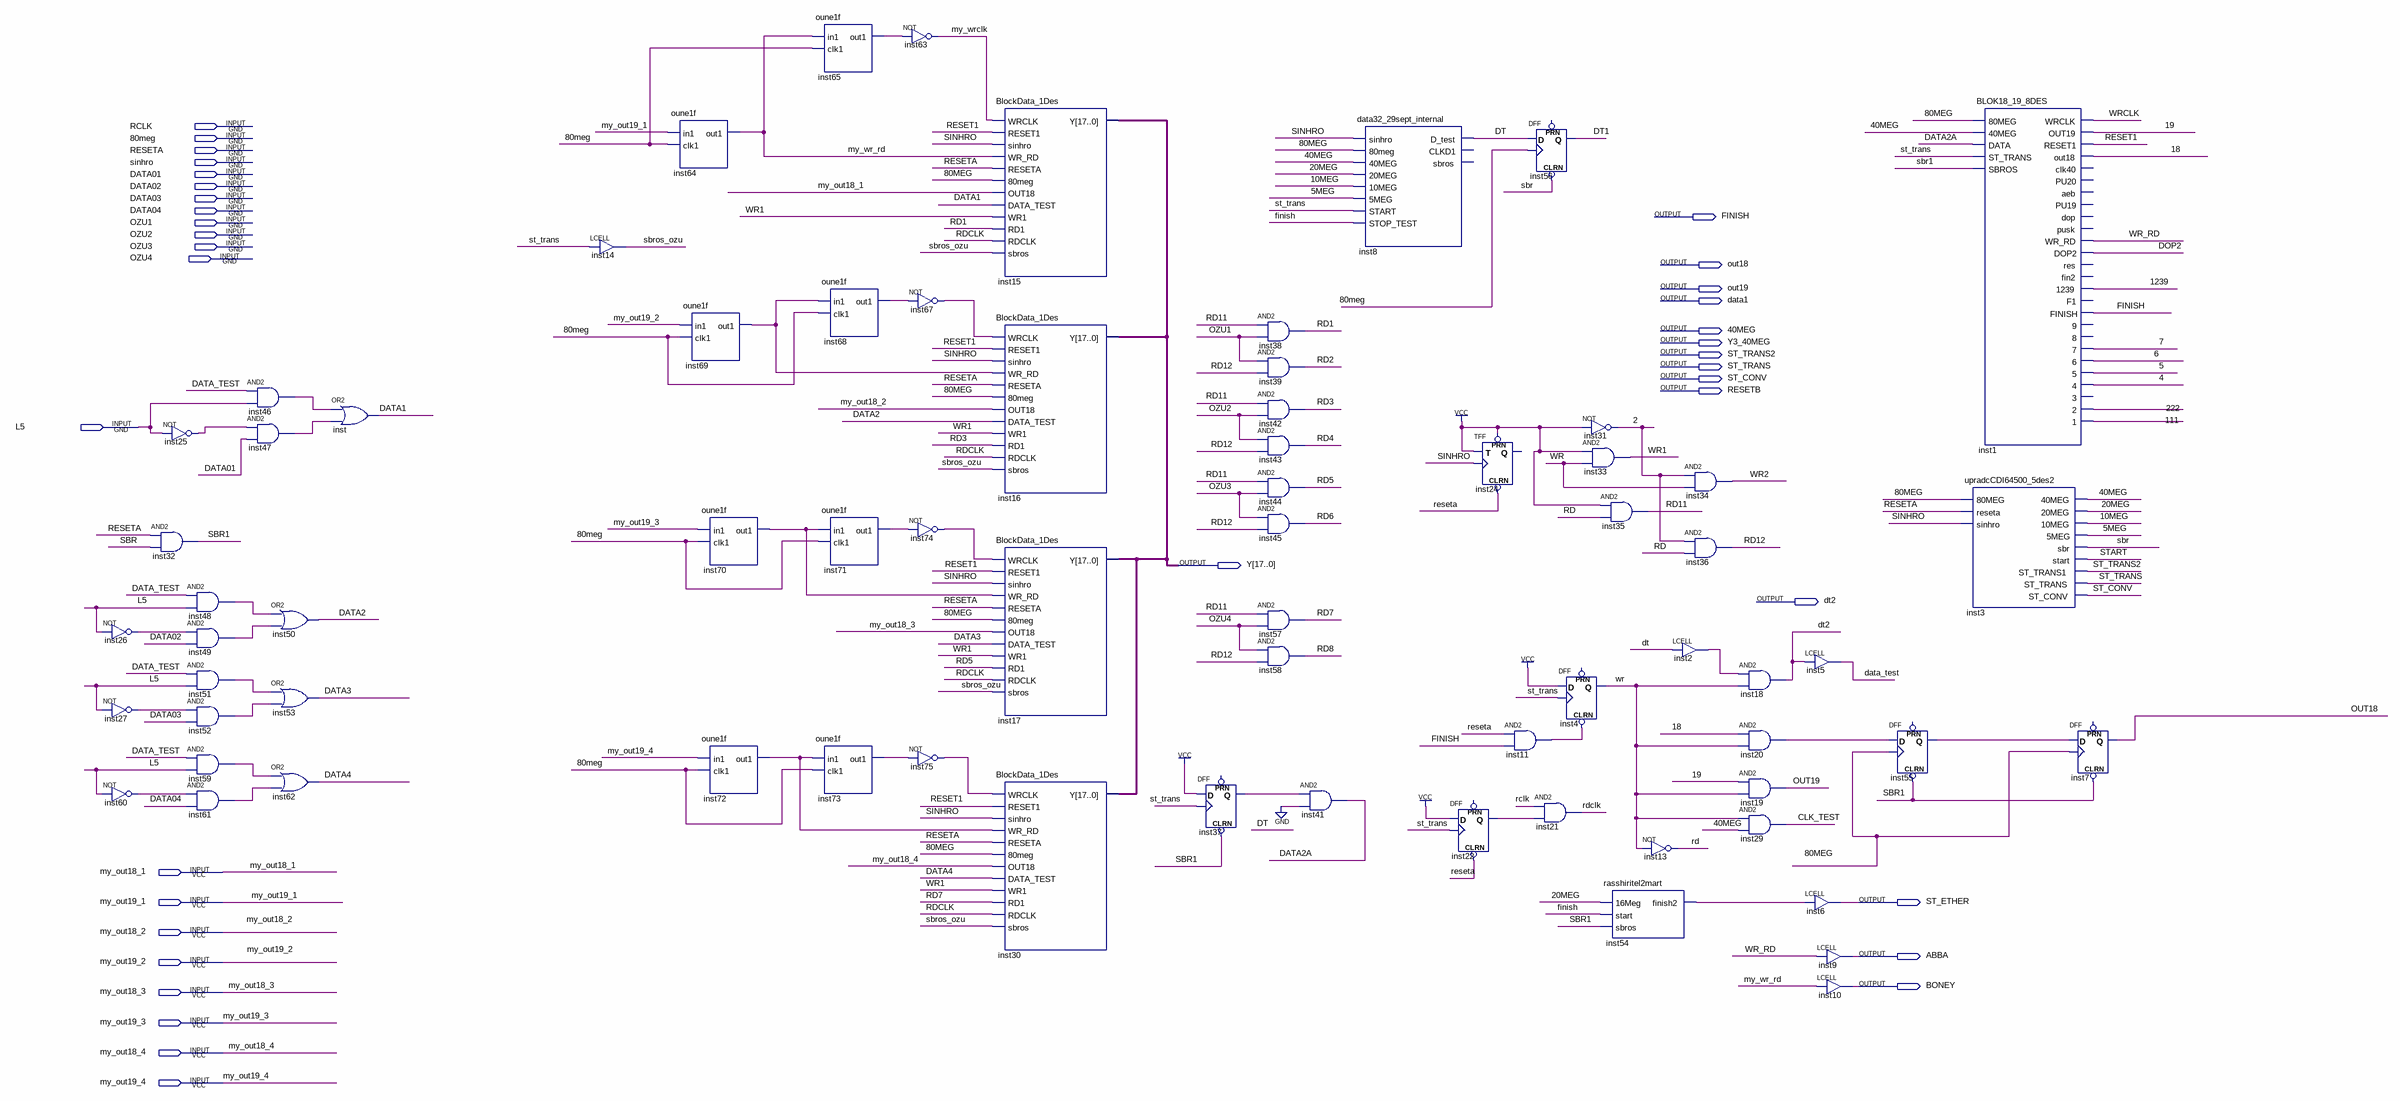
[diagram p0: schematic sheet]
// Quartus schematic blok_DATA_CDI_9des.bdf as structural Verilog: 71 symbols, 36 pins
module blok_DATA_CDI_9des (
  input  RCLK,
  input  \80meg ,
  input  RESETA,
  input  sinhro,
  input  DATA01,
  input  DATA02,
  input  DATA03,
  input  DATA04,
  input  OZU1,
  input  OZU2,
  input  OZU3,
  input  OZU4,
  input  L5,
  input  my_out18_1,
  input  my_out19_1,
  input  my_out18_2,
  input  my_out19_2,
  input  my_out18_3,
  input  my_out19_3,
  input  my_out18_4,
  input  my_out19_4,
  output FINISH,
  output out18,
  output out19,
  output data1,
  output \40MEG ,
  output Y3_40MEG,
  output ST_TRANS2,
  output ST_TRANS,
  output ST_CONV,
  output RESETB,
  output [17:0] Y,
  output dt2,
  output ST_ETHER,
  output ABBA,
  output BONEY
);

  wire \2 , \4 , \5 , \5MEG , \6 , \7 , \10MEG , \18 , \19 , \20MEG , \111 , \222 , \1239 , CLK_TEST, DATA2,
       DATA2A, DATA3, DATA4, data_test, DOP2, dt, DT1, inst2_out, inst11_out, inst20_out, inst22_q,
       inst25_out, inst26_out, inst27_out, inst37_q, inst46_out, inst47_out, inst48_out, inst49_out,
       inst51_out, inst52_out, inst54_finish2, inst55_q, inst59_out, inst60_out, inst61_out, inst65_out1,
       inst67_out, inst68_out1, inst69_out1, inst70_out1, inst71_out1, inst72_out1, inst73_out1, inst74_out,
       inst75_out, my_wr_rd, my_wrclk, RD, RD1, RD2, RD3, RD4, RD5, RD6, RD7, RD8, RD11, RD12, rdclk, RESET1,
       sbr, SBR1, sbros_ozu, START, WR, WR1, WR2, WR_RD, WRCLK;

  not inst26 (inst26_out, L5);
  not inst27 (inst27_out, L5);
  not inst60 (inst60_out, L5);
  not inst25 (inst25_out, L5);
  and inst32 (SBR1, RESETA, sbr);
  and inst48 (inst48_out, data_test, L5);
  and inst49 (inst49_out, inst26_out, DATA02);
  and inst51 (inst51_out, data_test, L5);
  and inst52 (inst52_out, inst27_out, DATA03);
  and inst59 (inst59_out, data_test, L5);
  and inst61 (inst61_out, inst60_out, DATA04);
  and inst46 (inst46_out, data_test, L5);
  and inst47 (inst47_out, inst25_out, DATA01);
  or inst50 (DATA2, inst48_out, inst49_out);
  or inst53 (DATA3, inst51_out, inst52_out);
  or inst62 (DATA4, inst59_out, inst61_out);
  or inst (data1, inst46_out, inst47_out);
  LCELL inst14 (.IN(ST_TRANS), .OUT(sbros_ozu));
  oune1f inst64 (.in1(my_out19_1), .clk1(\80meg ), .out1(my_wr_rd));
  oune1f inst69 (.in1(my_out19_2), .clk1(\80meg ), .out1(inst69_out1));
  oune1f inst70 (.in1(my_out19_3), .clk1(\80meg ), .out1(inst70_out1));
  oune1f inst72 (.in1(my_out19_4), .clk1(\80meg ), .out1(inst72_out1));
  oune1f inst65 (.in1(my_wr_rd), .clk1(\80meg ), .out1(inst65_out1));
  oune1f inst68 (.in1(inst69_out1), .clk1(\80meg ), .out1(inst68_out1));
  oune1f inst71 (.in1(inst70_out1), .clk1(\80meg ), .out1(inst71_out1));
  oune1f inst73 (.in1(inst72_out1), .clk1(\80meg ), .out1(inst73_out1));
  not inst63 (my_wrclk, inst65_out1);
  not inst67 (inst67_out, inst68_out1);
  not inst74 (inst74_out, inst71_out1);
  not inst75 (inst75_out, inst73_out1);
  BlockData_1Des inst15 (
    .WRCLK(my_wrclk), .RESET1(RESET1), .sinhro(sinhro), .WR_RD(my_wr_rd), .RESETA(RESETA), .\80meg (\80meg ),
    .OUT18(my_out18_1), .DATA_TEST(data1), .WR1(WR1), .RD1(RD1), .RDCLK(rdclk), .sbros(sbros_ozu), .Y(Y));
  BlockData_1Des inst16 (
    .WRCLK(inst67_out), .RESET1(RESET1), .sinhro(sinhro), .WR_RD(inst69_out1), .RESETA(RESETA),
    .\80meg (\80meg ), .OUT18(my_out18_2), .DATA_TEST(DATA2), .WR1(WR1), .RD1(RD3), .RDCLK(rdclk),
    .sbros(sbros_ozu), .Y(Y));
  BlockData_1Des inst17 (
    .WRCLK(inst74_out), .RESET1(RESET1), .sinhro(sinhro), .WR_RD(inst70_out1), .RESETA(RESETA),
    .\80meg (\80meg ), .OUT18(my_out18_3), .DATA_TEST(DATA3), .WR1(WR1), .RD1(RD5), .RDCLK(rdclk),
    .sbros(sbros_ozu), .Y(Y));
  BlockData_1Des inst30 (
    .WRCLK(inst75_out), .RESET1(RESET1), .sinhro(sinhro), .WR_RD(inst72_out1), .RESETA(RESETA),
    .\80meg (\80meg ), .OUT18(my_out18_4), .DATA_TEST(DATA4), .WR1(WR1), .RD1(RD7), .RDCLK(rdclk),
    .sbros(sbros_ozu), .Y(Y));
  DFF inst37 (.CLRN(SBR1), .CLK(ST_TRANS), .D(1'b1), .Q(inst37_q));  // open: PRN
  and inst38 (RD1, RD11, OZU1);
  and inst39 (RD2, OZU1, RD12);
  and inst42 (RD3, RD11, OZU2);
  and inst43 (RD4, OZU2, RD12);
  and inst44 (RD5, RD11, OZU3);
  and inst45 (RD6, OZU3, RD12);
  and inst57 (RD7, RD11, OZU4);
  and inst58 (RD8, OZU4, RD12);
  and inst41 (DATA2A, inst37_q, 1'b0);
  data32_29sept_internal inst8 (
    .sinhro(sinhro), .\80meg (\80meg ), .\40MEG (\40MEG ), .\20MEG (\20MEG ), .\10MEG (\10MEG ),
    .\5MEG (\5MEG ), .START(ST_TRANS), .STOP_TEST(FINISH), .D_test(dt));  // open: CLKD1, sbros
  TFF inst24 (.PRN(1'b1), .CLRN(RESETA), .T(1'b1), .CLK(sinhro));  // open: Q
  DFF inst22 (.CLRN(RESETA), .CLK(ST_TRANS), .D(1'b1), .Q(inst22_q));  // open: PRN
  DFF inst56 (.CLRN(sbr), .CLK(\80meg ), .D(dt), .Q(DT1));  // open: PRN
  and inst11 (inst11_out, RESETA, FINISH);
  DFF inst4 (.CLRN(inst11_out), .CLK(ST_TRANS), .D(1'b1), .Q(WR));  // open: PRN
  and inst21 (rdclk, RCLK, inst22_q);
  not inst31 (\2 , 1'b1);
  and inst33 (WR1, 1'b1, WR);
  and inst35 (RD11, 1'b1, RD);
  rasshiritel2mart inst54 (.\16Meg (\20MEG ), .start(FINISH), .sbros(SBR1), .finish2(inst54_finish2));
  LCELL inst2 (.IN(dt), .OUT(inst2_out));
  not inst13 (RD, WR);
  and inst34 (WR2, \2 , WR);
  and inst36 (RD12, \2 , RD);
  and inst18 (dt2, inst2_out, WR);
  and inst20 (inst20_out, \18 , WR);
  and inst19 (out19, \19 , WR);
  and inst29 (CLK_TEST, WR, \40MEG );
  LCELL inst5 (.IN(dt2), .OUT(data_test));
  LCELL inst6 (.IN(inst54_finish2), .OUT(ST_ETHER));
  LCELL inst9 (.IN(WR_RD), .OUT(ABBA));
  LCELL inst10 (.IN(my_wr_rd), .OUT(BONEY));
  DFF inst55 (.CLRN(SBR1), .CLK(\80meg ), .D(inst20_out), .Q(inst55_q));  // open: PRN
  upradcCDI64500_5des2 inst3 (
    .\80MEG (\80meg ), .reseta(RESETA), .sinhro(sinhro), .\40MEG (\40MEG ), .\20MEG (\20MEG ),
    .\10MEG (\10MEG ), .\5MEG (\5MEG ), .sbr(sbr), .start(START), .ST_TRANS1(ST_TRANS2), .ST_TRANS(ST_TRANS),
    .ST_CONV(ST_CONV));
  BLOK18_19_8DES inst1 (
    .\80MEG (\80meg ), .\40MEG (\40MEG ), .DATA(DATA2A), .ST_TRANS(ST_TRANS), .SBROS(SBR1), .WRCLK(WRCLK),
    .OUT19(\19 ), .RESET1(RESET1), .out18(\18 ), .WR_RD(WR_RD), .DOP2(DOP2), .\1239 (\1239 ),
    .FINISH(FINISH), .\7 (\7 ), .\6 (\6 ), .\5 (\5 ), .\4 (\4 ), .\2 (\222 ), .\1 (\111 ));  // open: clk40, PU20, aeb, PU19, dop, pusk, res, fin2, F1, 9, 8, 3
  DFF inst7 (.CLRN(SBR1), .CLK(\80meg ), .D(inst55_q), .Q(out18));  // open: PRN
endmodule
